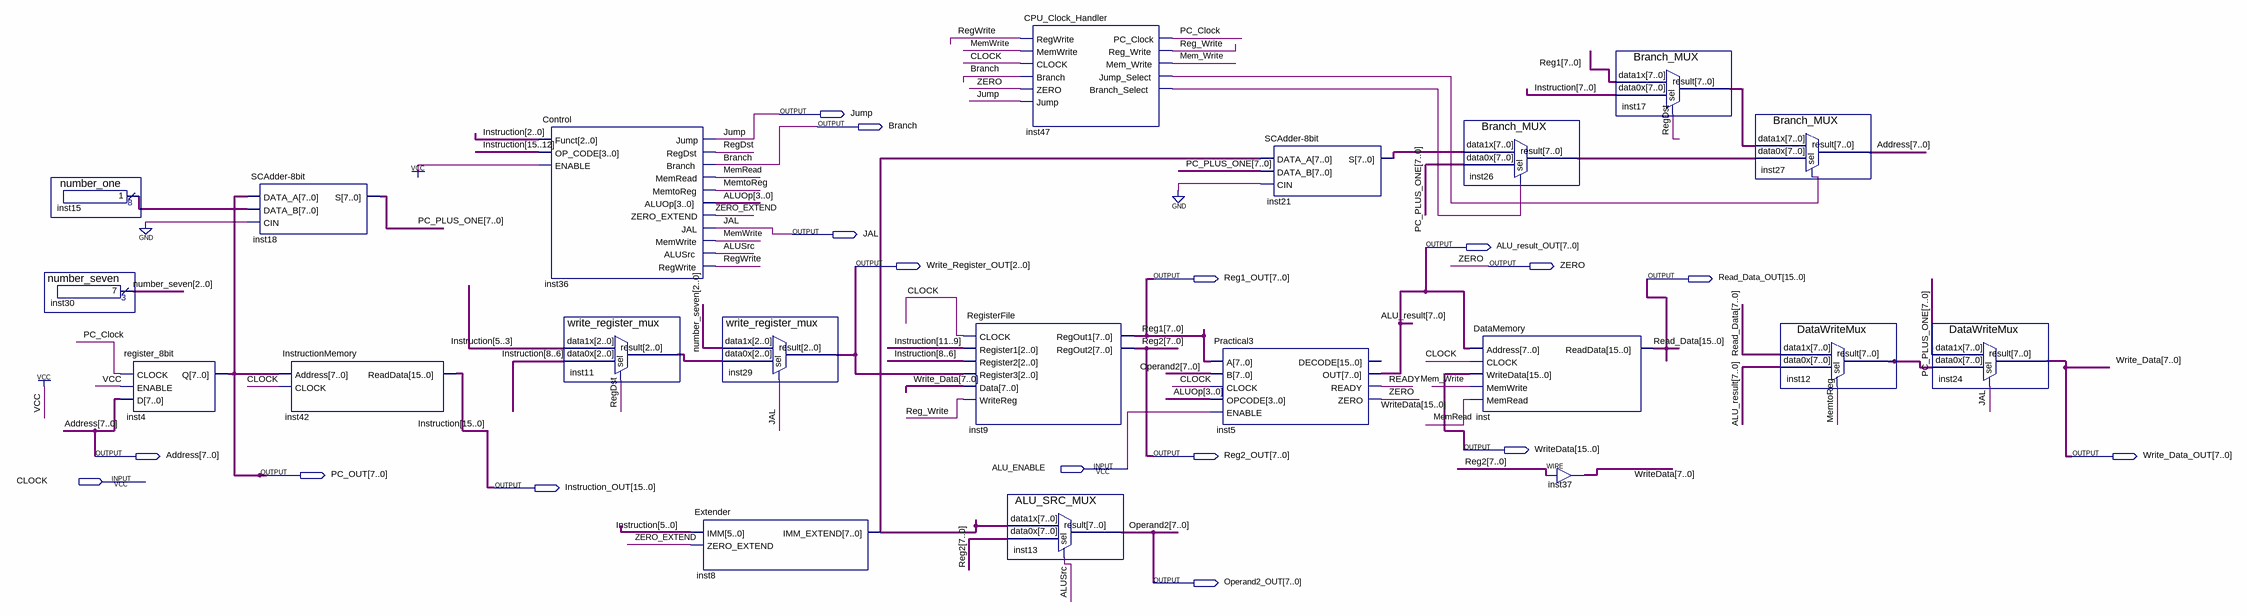
[diagram p0: schematic sheet]
// Quartus schematic MIPS_CPU.bdf as structural Verilog: 21 symbols, 17 pins
module MIPS_CPU (
  input  ALU_ENABLE,
  input  CLOCK,
  output Jump,
  output Branch,
  output JAL,
  output [7:0] ALU_result_OUT,
  output [2:0] Write_Register_OUT,
  output ZERO,
  output [7:0] Reg1_OUT,
  output [15:0] Read_Data_OUT,
  output [15:0] WriteData,
  output [7:0] Address,
  output [7:0] Reg2_OUT,
  output [7:0] Write_Data_OUT,
  output [7:0] PC_OUT,
  output [15:0] Instruction_OUT,
  output [7:0] Operand2_OUT
);

  wire ALUSrc, inst47_branch_select, inst47_jump_select, Mem_Write, MemRead, MemtoReg, MemWrite, PC_Clock,
       READY, Reg_Write, RegDst, RegWrite, ZERO_EXTEND;
  wire [2:0] inst11_result, number_seven;
  wire [3:0] ALUOp;
  wire [7:0] inst8_imm_extend, inst12_result, inst15_result, inst17_result, inst21_s, inst26_result,
       PC_PLUS_ONE;

  number_one inst15 (.result(inst15_result));
  number_seven inst30 (.result(number_seven));
  register_8bit inst4 (.CLOCK(PC_Clock), .ENABLE(1'b1), .D(Address), .Q(PC_OUT));
  \SCAdder-8bit  inst18 (.DATA_A(PC_OUT), .DATA_B(inst15_result), .CIN(1'b0), .S(PC_PLUS_ONE));
  InstructionMemory inst42 (.Address(PC_OUT), .CLOCK(CLOCK), .ReadData(Instruction_OUT));
  Control inst36 (
    .Funct(Instruction_OUT[2:0]), .OP_CODE(Instruction_OUT[15:12]), .ENABLE(1'b1), .Jump(Jump),
    .RegDst(RegDst), .Branch(Branch), .MemRead(MemRead), .MemtoReg(MemtoReg), .ALUOp(ALUOp),
    .ZERO_EXTEND(ZERO_EXTEND), .JAL(JAL), .MemWrite(MemWrite), .ALUSrc(ALUSrc), .RegWrite(RegWrite));
  write_register_mux inst11 (
    .data1x(Instruction_OUT[5:3]), .data0x(Instruction_OUT[8:6]), .sel(RegDst), .result(inst11_result));
  write_register_mux inst29 (.data1x(number_seven), .data0x(inst11_result), .sel(JAL), .result(Write_Register_OUT));
  Extender inst8 (.IMM(Instruction_OUT[5:0]), .ZERO_EXTEND(ZERO_EXTEND), .IMM_EXTEND(inst8_imm_extend));
  RegisterFile inst9 (
    .CLOCK(CLOCK), .Register1(Instruction_OUT[11:9]), .Register2(Instruction_OUT[8:6]),
    .Register3(Write_Register_OUT), .Data(Write_Data_OUT), .WriteReg(Reg_Write), .RegOut1(Reg1_OUT),
    .RegOut2(Reg2_OUT));
  CPU_Clock_Handler inst47 (
    .RegWrite(RegWrite), .MemWrite(MemWrite), .CLOCK(CLOCK), .Branch(Branch), .ZERO(ZERO), .Jump(Jump),
    .PC_Clock(PC_Clock), .Reg_Write(Reg_Write), .Mem_Write(Mem_Write), .Jump_Select(inst47_jump_select),
    .Branch_Select(inst47_branch_select));
  ALU_SRC_MUX inst13 (.data1x(inst8_imm_extend), .data0x(Reg2_OUT), .sel(ALUSrc), .result(Operand2_OUT));
  Practical3 inst5 (
    .A(Reg1_OUT), .B(Operand2_OUT), .CLOCK(CLOCK), .OPCODE(ALUOp), .ENABLE(ALU_ENABLE), .OUT(ALU_result_OUT),
    .READY(READY), .ZERO(ZERO));  // open: DECODE
  \SCAdder-8bit  inst21 (.DATA_A(inst8_imm_extend), .DATA_B(PC_PLUS_ONE), .CIN(1'b0), .S(inst21_s));
  Branch_MUX inst26 (.data1x(inst21_s), .data0x(PC_PLUS_ONE), .sel(inst47_branch_select), .result(inst26_result));
  DataMemory inst (
    .Address(ALU_result_OUT), .CLOCK(CLOCK), .WriteData(WriteData), .MemWrite(Mem_Write), .MemRead(MemRead),
    .ReadData(Read_Data_OUT));
  assign WriteData[7:0] = Reg2_OUT;  // WIRE inst37
  Branch_MUX inst17 (.data1x(Reg1_OUT), .data0x(Instruction_OUT[7:0]), .sel(RegDst), .result(inst17_result));
  Branch_MUX inst27 (.data1x(inst17_result), .data0x(inst26_result), .sel(inst47_jump_select), .result(Address));
  DataWriteMux inst12 (.data1x(Read_Data_OUT[7:0]), .data0x(ALU_result_OUT), .sel(MemtoReg), .result(inst12_result));
  DataWriteMux inst24 (.data1x(PC_PLUS_ONE), .data0x(inst12_result), .sel(JAL), .result(Write_Data_OUT));

  // Other names for the same wires on the sheet: ALU_result[7:0] = ALU_result_OUT;
  //   Instruction[15:0] = Instruction_OUT; Operand2[7:0] = Operand2_OUT; Read_Data[15:0] = Read_Data_OUT;
  //   Reg1[7:0] = Reg1_OUT; Reg2[7:0] = Reg2_OUT; Write_Data[7:0] = Write_Data_OUT
endmodule
